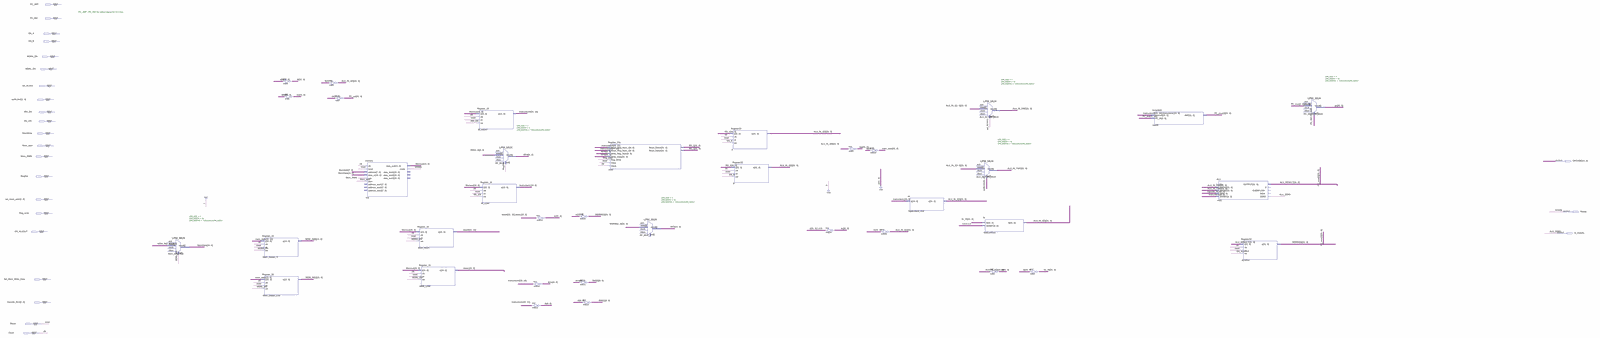
[diagram p0: schematic sheet, whole]
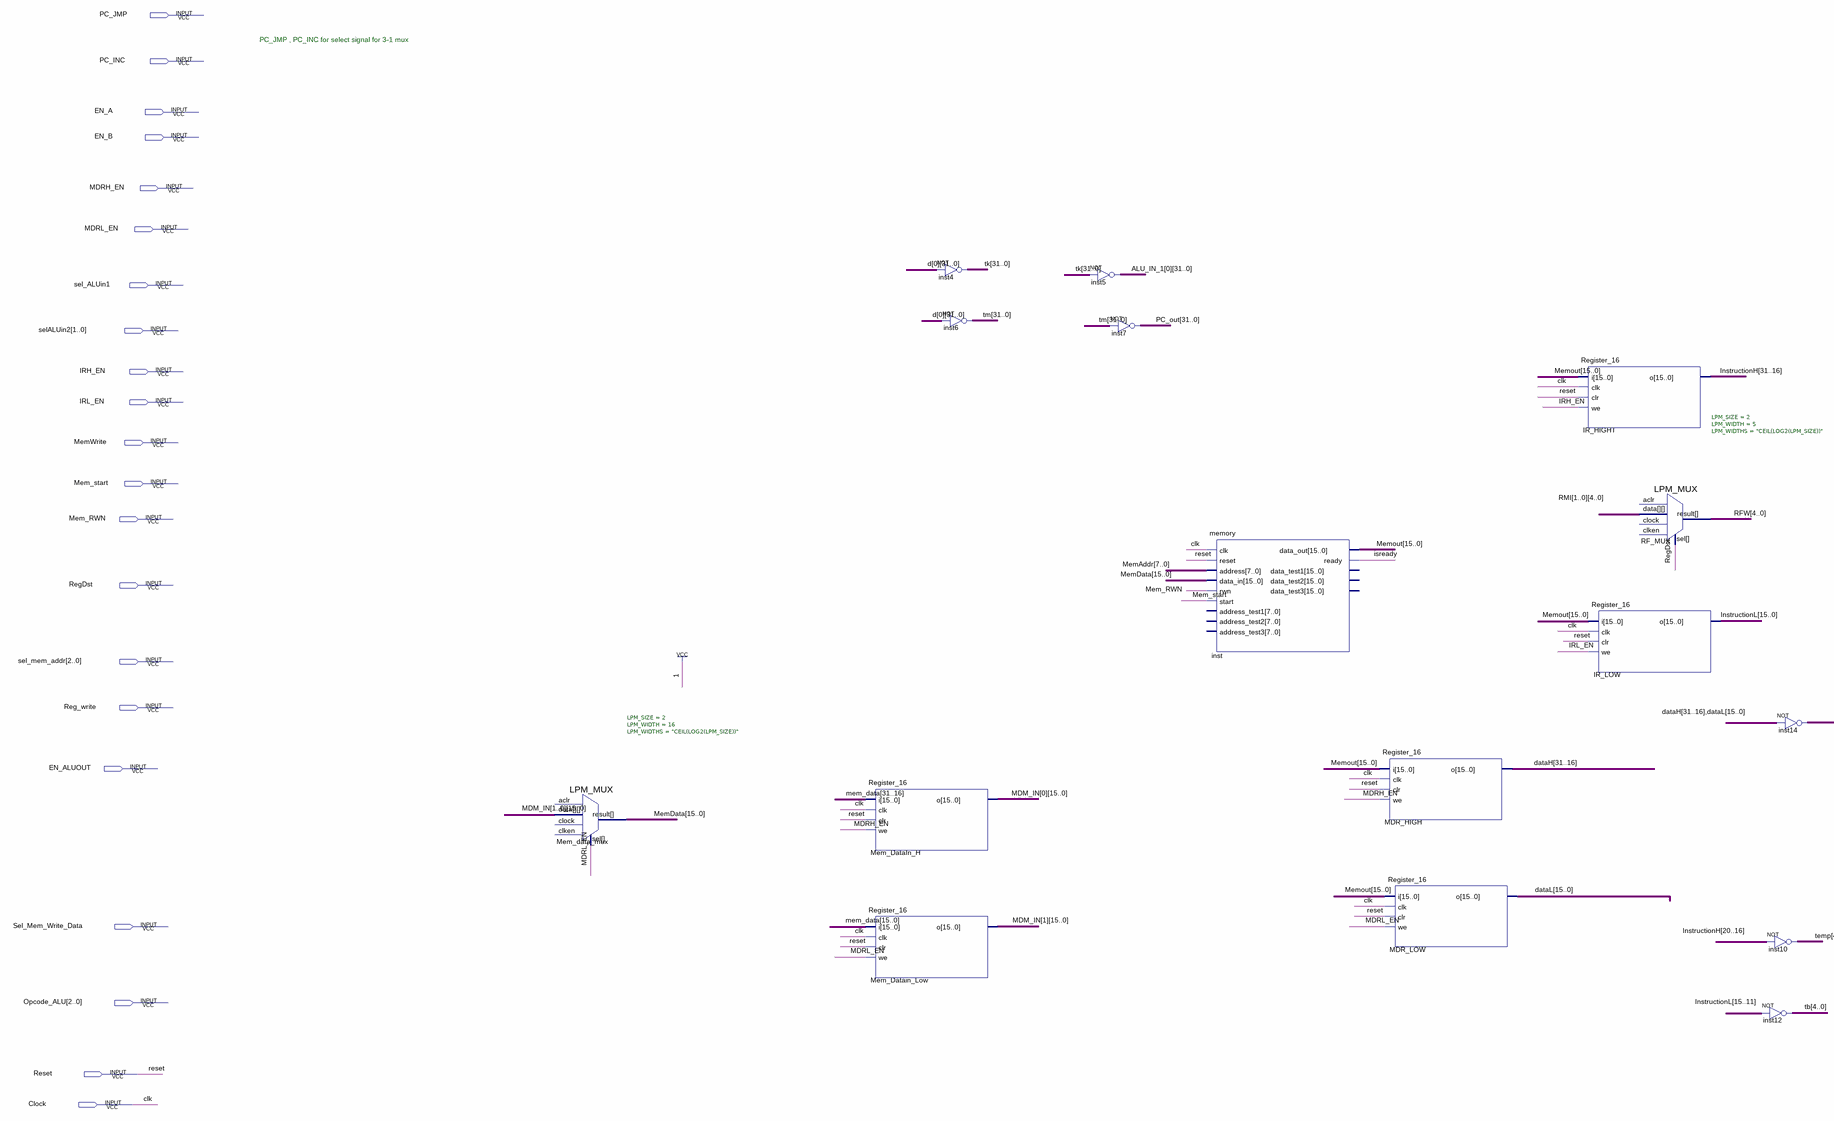
[diagram p1: schematic sheet, left part]
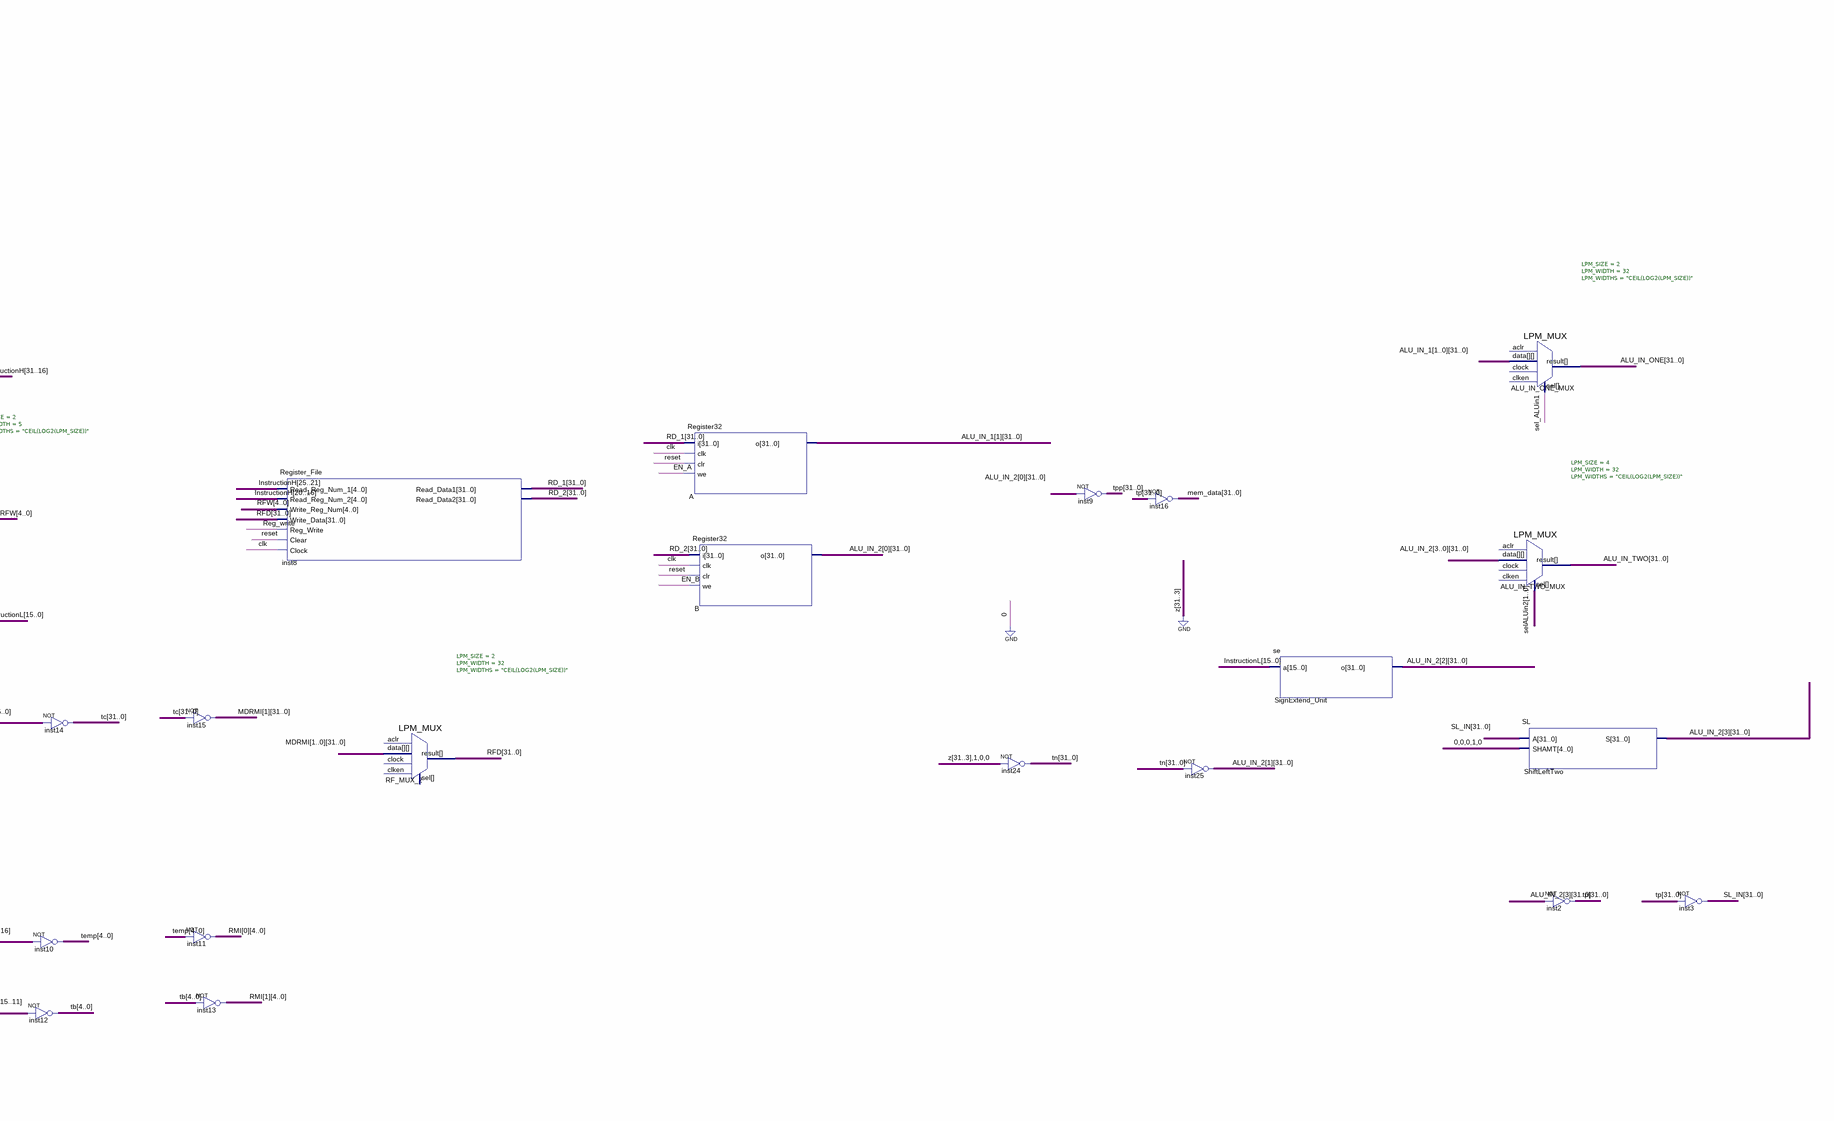
[diagram p2: schematic sheet, centre part]
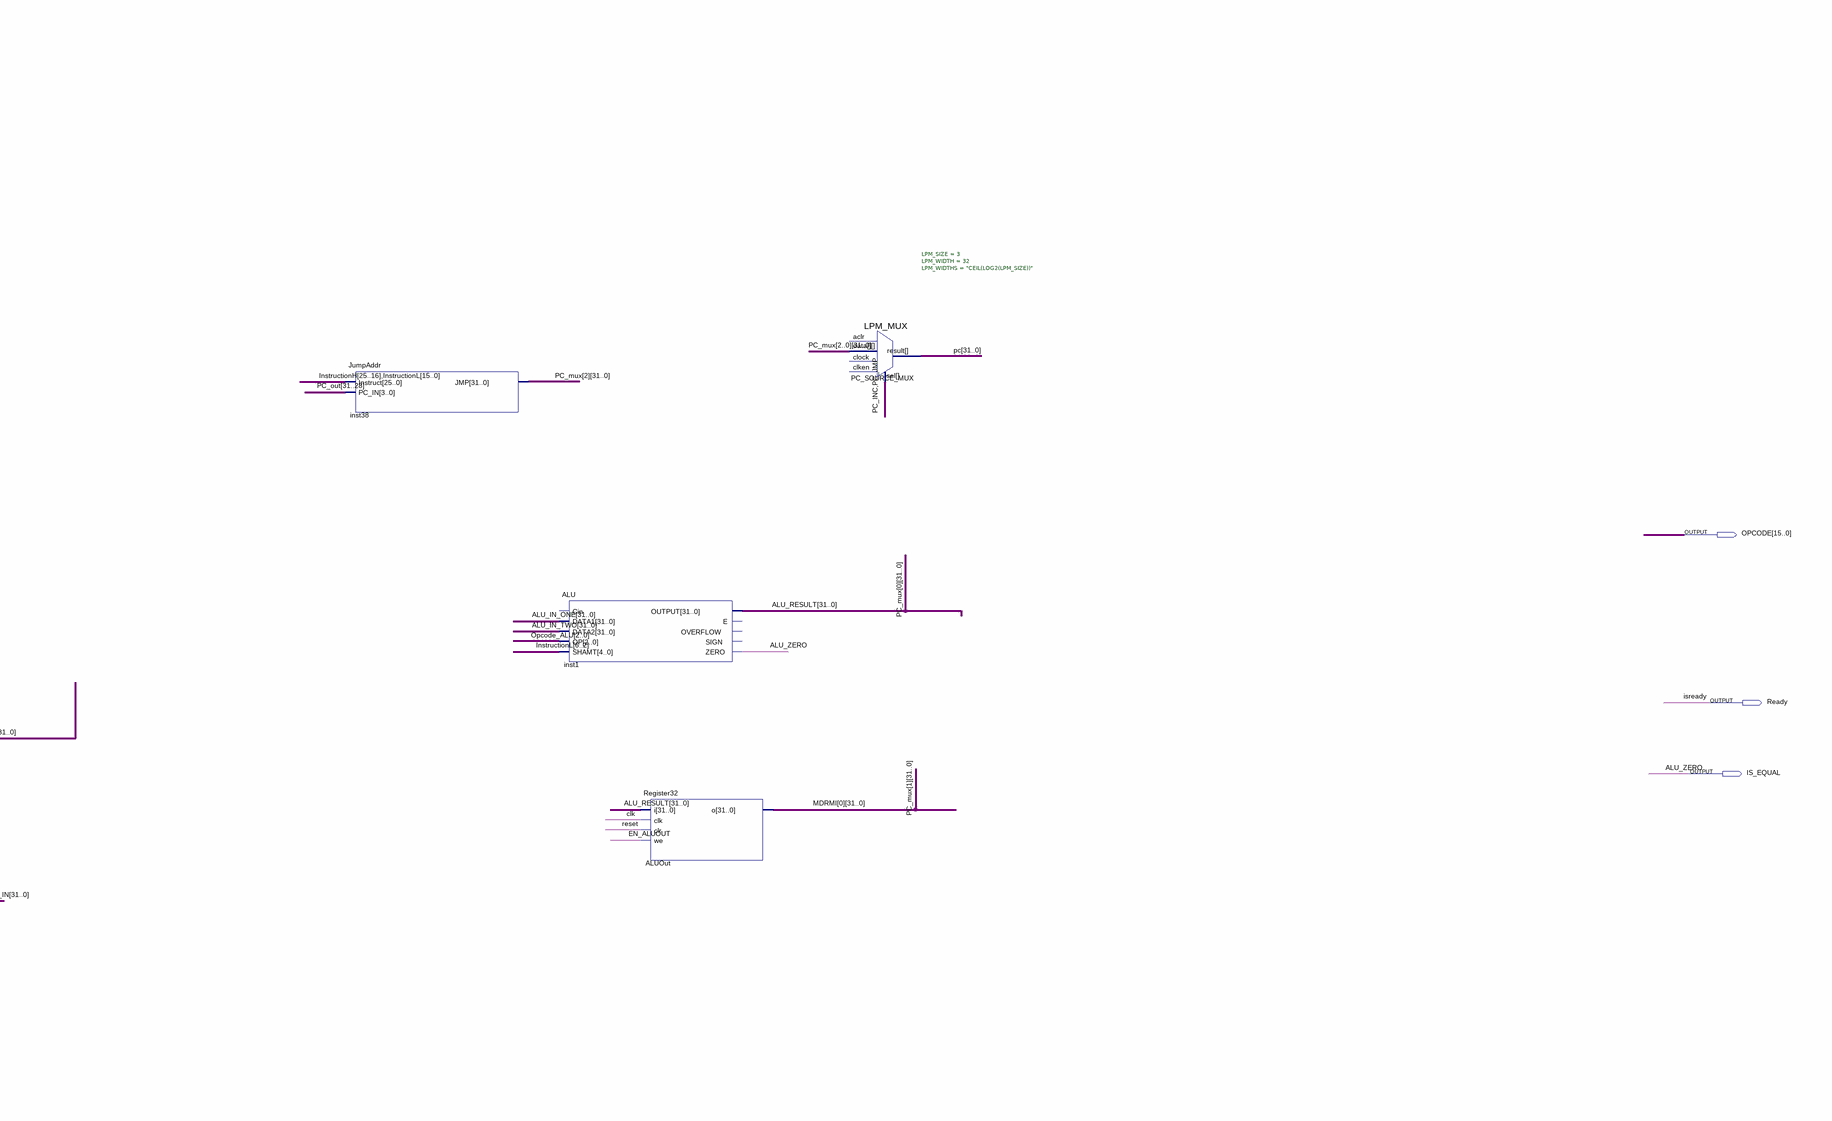
[diagram p3: schematic sheet, right part]
// Quartus schematic DataPath.bdf as structural Verilog: 37 symbols, 24 pins
module DataPath (
  input  PC_JMP,
  input  PC_INC,
  input  EN_A,
  input  EN_B,
  input  MDRH_EN,
  input  MDRL_EN,
  input  sel_ALUin1,
  input  [1:0] selALUin2,
  input  IRH_EN,
  input  IRL_EN,
  input  MemWrite,
  input  Mem_start,
  input  Mem_RWN,
  input  RegDst,
  input  [2:0] sel_mem_addr,
  input  Reg_write,
  input  EN_ALUOUT,
  input  Sel_Mem_Write_Data,
  input  [2:0] Opcode_ALU,
  input  Reset,
  input  Clock,
  output [15:0] OPCODE,
  output Ready,
  output IS_EQUAL
);

  wire [4:0] RFW, RMI_0, RMI_1, tb, temp;
  wire [7:0] MemAddr;
  wire [15:0] dataL, InstructionL, MDM_IN_0, MDM_IN_1, MemData, Memout;
  wire [31:0] ALU_IN_1_0, ALU_IN_1_1, ALU_IN_2_0, ALU_IN_2_1, ALU_IN_2_2, ALU_IN_2_3, ALU_IN_ONE, ALU_IN_TWO,
       ALU_RESULT, d_0, MDRMI_0, MDRMI_1, mem_data, pc, PC_mux_0, PC_mux_1, PC_mux_2, PC_out, RD_1, RD_2,
       RFD, SL_IN, tc, tk, tm, tn, tp, tpp;
  wire [31:16] dataH, InstructionH;

  LPM_MUX #(.LPM_SIZE(2), .LPM_WIDTH(16), .LPM_WIDTHS("CEIL(LOG2(LPM_SIZE))")) Mem_data_mux (
    .data({MDM_IN_1, MDM_IN_0}), .sel(MDRL_EN), .result(MemData));  // open: clock, aclr, clken
  Register_16 Mem_DataIn_H (.i(mem_data[31:16]), .clk(Clock), .clr(Reset), .we(MDRH_EN), .o(MDM_IN_0));
  Register_16 Mem_Datain_Low (.i(mem_data[15:0]), .clk(Clock), .clr(Reset), .we(MDRL_EN), .o(MDM_IN_1));
  assign tk = ~d_0;  // NOT inst4, 32 bits wide
  assign tm = ~d_0;  // NOT inst6, 32 bits wide
  assign ALU_IN_1_0 = ~tk;  // NOT inst5, 32 bits wide
  assign PC_out = ~tm;  // NOT inst7, 32 bits wide
  memory inst (
    .clk(Clock), .reset(Reset), .address(MemAddr), .data_in(MemData), .rwn(Mem_RWN), .start(Mem_start),
    .data_out(Memout), .ready(Ready));  // open: address_test1, address_test2, address_test3, data_test1, data_test2, data_test3
  Register_16 MDR_HIGH (.i(Memout), .clk(Clock), .clr(Reset), .we(MDRH_EN), .o(dataH));
  Register_16 MDR_LOW (.i(Memout), .clk(Clock), .clr(Reset), .we(MDRL_EN), .o(dataL));
  Register_16 IR_HIGHT (.i(Memout), .clk(Clock), .clr(Reset), .we(IRH_EN), .o(InstructionH));
  Register_16 IR_LOW (.i(Memout), .clk(Clock), .clr(Reset), .we(IRL_EN), .o(InstructionL));
  LPM_MUX #(.LPM_SIZE(2), .LPM_WIDTH(5), .LPM_WIDTHS("CEIL(LOG2(LPM_SIZE))")) RF_MUX (
    .data({RMI_1, RMI_0}), .sel(RegDst), .result(RFW));  // open: clock, aclr, clken
  assign tb = ~InstructionL[15:11];  // NOT inst12, 5 bits wide
  assign tc = ~{dataH, dataL};  // NOT inst14, 32 bits wide
  assign temp = ~InstructionH[20:16];  // NOT inst10, 5 bits wide
  assign MDRMI_1 = ~tc;  // NOT inst15, 32 bits wide
  assign RMI_0 = ~temp;  // NOT inst11, 5 bits wide
  assign RMI_1 = ~tb;  // NOT inst13, 5 bits wide
  Register_File inst8 (
    .Read_Reg_Num_1(InstructionH[25:21]), .Read_Reg_Num_2(InstructionH[20:16]), .Write_Reg_Num(RFW),
    .Write_Data(RFD), .Reg_Write(Reg_write), .Clear(Reset), .Clock(Clock), .Read_Data1(RD_1),
    .Read_Data2(RD_2));
  LPM_MUX #(.LPM_SIZE(2), .LPM_WIDTH(32), .LPM_WIDTHS("CEIL(LOG2(LPM_SIZE))")) RF_MUX_2 (
    .data({MDRMI_1, MDRMI_0}), .result(RFD));  // open: clock, aclr, sel, clken
  Register32 A (.i(RD_1), .clk(Clock), .clr(Reset), .we(EN_A), .o(ALU_IN_1_1));
  Register32 B (.i(RD_2), .clk(Clock), .clr(Reset), .we(EN_B), .o(ALU_IN_2_0));
  assign tn = ~32'b00000000000000000000000000000100;  // NOT inst24, 32 bits wide
  assign tpp = ~ALU_IN_2_0;  // NOT inst9, 32 bits wide
  assign mem_data = ~tp;  // NOT inst16, 32 bits wide
  assign ALU_IN_2_1 = ~tn;  // NOT inst25, 32 bits wide
  se SignExtend_Unit (.a(InstructionL), .o(ALU_IN_2_2));
  LPM_MUX #(.LPM_SIZE(2), .LPM_WIDTH(32), .LPM_WIDTHS("CEIL(LOG2(LPM_SIZE))")) ALU_IN_ONE_MUX (
    .data({ALU_IN_1_1, ALU_IN_1_0}), .sel(sel_ALUin1), .result(ALU_IN_ONE));  // open: clock, aclr, clken
  LPM_MUX #(.LPM_SIZE(4), .LPM_WIDTH(32), .LPM_WIDTHS("CEIL(LOG2(LPM_SIZE))")) ALU_IN_TWO_MUX (
    .data({ALU_IN_2_3, ALU_IN_2_2, ALU_IN_2_1, ALU_IN_2_0}), .sel(selALUin2), .result(ALU_IN_TWO));  // open: clock, aclr, clken
  SL ShiftLeftTwo (.A(SL_IN), .SHAMT(5'b00010), .S(ALU_IN_2_3));
  assign tp = ~ALU_IN_2_3;  // NOT inst2, 32 bits wide
  assign SL_IN = ~tp;  // NOT inst3, 32 bits wide
  JumpAddr inst38 (.Instruct({InstructionH[25:16], InstructionL}), .PC_IN(PC_out[31:28]), .JMP(PC_mux_2));
  ALU inst1 (
    .DATA1(ALU_IN_ONE), .DATA2(ALU_IN_TWO), .OP(Opcode_ALU), .SHAMT(InstructionL[6:2]), .OUTPUT(ALU_RESULT),
    .ZERO(IS_EQUAL));  // open: Cin, E, OVERFLOW, SIGN
  Register32 ALUOut (.i(ALU_RESULT), .clk(Clock), .clr(Reset), .we(EN_ALUOUT), .o(MDRMI_0));
  LPM_MUX #(.LPM_SIZE(3), .LPM_WIDTH(32), .LPM_WIDTHS("CEIL(LOG2(LPM_SIZE))")) PC_SOURCE_MUX (
    .data({PC_mux_2, PC_mux_1, PC_mux_0}), .sel({PC_INC, PC_JMP}), .result(pc));  // open: clock, aclr, clken

  // Other names for the same wires on the sheet: ALU_ZERO = IS_EQUAL; clk = Clock; isready = Ready

  // Notes on the sheet:
  //   PC_JMP , PC_INC for select signal for 3-1 mux
endmodule
